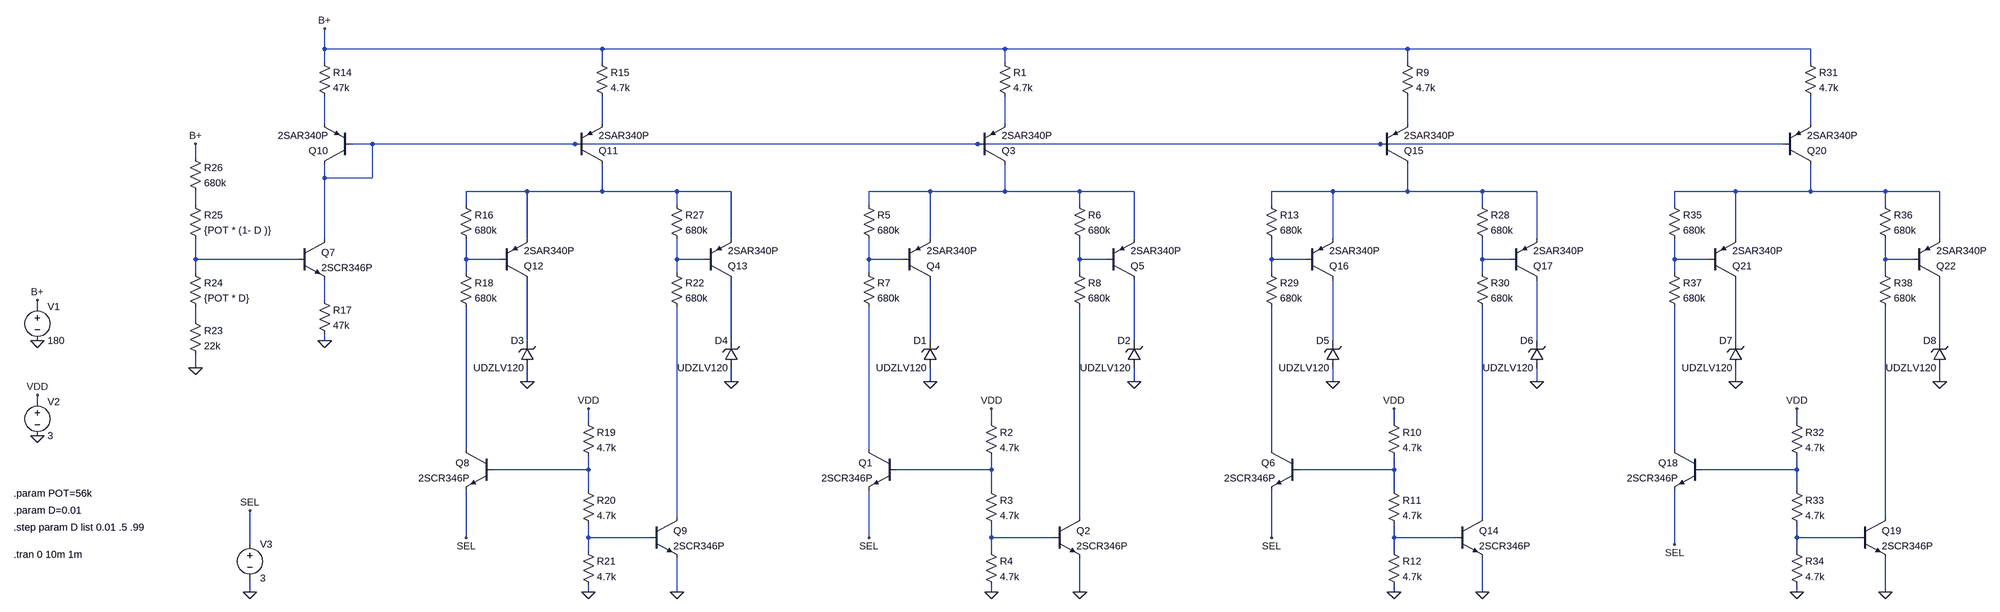
[diagram p0: schematic Constant Current Anode Switching.asc]
Constant Current Anode Switching.asc, the LTspice schematic file:
Version 4
SHEET 1 5280 1044
WIRE 736 -592 736 -640
WIRE 1552 -592 736 -592
WIRE 2640 -592 1552 -592
WIRE 3744 -592 2640 -592
WIRE 4832 -592 3744 -592
WIRE 736 -560 736 -592
WIRE 1552 -560 1552 -592
WIRE 2640 -560 2640 -592
WIRE 3744 -560 3744 -592
WIRE 4832 -560 4832 -592
WIRE 736 -416 736 -480
WIRE 1552 -416 1552 -480
WIRE 2640 -416 2640 -480
WIRE 3744 -416 3744 -480
WIRE 4832 -416 4832 -480
WIRE 848 -368 800 -368
WIRE 1488 -368 848 -368
WIRE 2576 -368 1488 -368
WIRE 3680 -368 2576 -368
WIRE 4768 -368 3680 -368
WIRE 432 -336 432 -368
WIRE 736 -288 736 -320
WIRE 848 -288 848 -368
WIRE 848 -288 736 -288
WIRE 1376 -256 1232 -256
WIRE 1552 -256 1552 -320
WIRE 1552 -256 1376 -256
WIRE 1728 -256 1552 -256
WIRE 1856 -256 1728 -256
WIRE 2464 -256 2320 -256
WIRE 2640 -256 2640 -320
WIRE 2640 -256 2464 -256
WIRE 2816 -256 2640 -256
WIRE 2944 -256 2816 -256
WIRE 3568 -256 3424 -256
WIRE 3744 -256 3744 -320
WIRE 3744 -256 3568 -256
WIRE 3920 -256 3744 -256
WIRE 4048 -256 3920 -256
WIRE 4656 -256 4512 -256
WIRE 4832 -256 4832 -320
WIRE 4832 -256 4656 -256
WIRE 5008 -256 4832 -256
WIRE 5136 -256 5008 -256
WIRE 432 -224 432 -256
WIRE 1232 -224 1232 -256
WIRE 1728 -224 1728 -256
WIRE 2320 -224 2320 -256
WIRE 2816 -224 2816 -256
WIRE 3424 -224 3424 -256
WIRE 3920 -224 3920 -256
WIRE 4512 -224 4512 -256
WIRE 5008 -224 5008 -256
WIRE 736 -144 736 -288
WIRE 1376 -144 1376 -256
WIRE 1856 -144 1856 -256
WIRE 2464 -144 2464 -256
WIRE 2944 -144 2944 -256
WIRE 3568 -144 3568 -256
WIRE 4048 -144 4048 -256
WIRE 4656 -144 4656 -256
WIRE 5136 -144 5136 -256
WIRE 432 -96 432 -144
WIRE 672 -96 432 -96
WIRE 1232 -96 1232 -144
WIRE 1312 -96 1232 -96
WIRE 1728 -96 1728 -144
WIRE 1792 -96 1728 -96
WIRE 2320 -96 2320 -144
WIRE 2400 -96 2320 -96
WIRE 2816 -96 2816 -144
WIRE 2880 -96 2816 -96
WIRE 3424 -96 3424 -144
WIRE 3504 -96 3424 -96
WIRE 3920 -96 3920 -144
WIRE 3984 -96 3920 -96
WIRE 4512 -96 4512 -144
WIRE 4592 -96 4512 -96
WIRE 5008 -96 5008 -144
WIRE 5072 -96 5008 -96
WIRE 432 -64 432 -96
WIRE 1232 -64 1232 -96
WIRE 1728 -64 1728 -96
WIRE 2320 -64 2320 -96
WIRE 2816 -64 2816 -96
WIRE 3424 -64 3424 -96
WIRE 3920 -64 3920 -96
WIRE 4512 -64 4512 -96
WIRE 5008 -64 5008 -96
WIRE 736 0 736 -48
WIRE -80 16 -80 0
WIRE 432 48 432 16
WIRE 736 96 736 80
WIRE 1376 96 1376 -48
WIRE 1856 96 1856 -48
WIRE 2464 96 2464 -48
WIRE 2944 96 2944 -48
WIRE 3568 96 3568 -48
WIRE 4048 96 4048 -48
WIRE 4656 96 4656 -48
WIRE 5136 96 5136 -48
WIRE 432 160 432 128
WIRE 1376 192 1376 160
WIRE 1856 192 1856 160
WIRE 2464 192 2464 160
WIRE 2944 192 2944 160
WIRE 3568 192 3568 160
WIRE 4048 192 4048 160
WIRE 4656 192 4656 160
WIRE 5136 192 5136 160
WIRE -80 240 -80 224
WIRE 1520 288 1520 256
WIRE 2608 288 2608 256
WIRE 3712 288 3712 256
WIRE 4800 288 4800 256
WIRE 1232 352 1232 16
WIRE 2320 352 2320 16
WIRE 3424 352 3424 16
WIRE 4512 352 4512 16
WIRE 1520 400 1520 368
WIRE 1520 400 1296 400
WIRE 2608 400 2608 368
WIRE 2608 400 2384 400
WIRE 3712 400 3712 368
WIRE 3712 400 3488 400
WIRE 4800 400 4800 368
WIRE 4800 400 4576 400
WIRE 1520 448 1520 400
WIRE 2608 448 2608 400
WIRE 3712 448 3712 400
WIRE 4800 448 4800 400
WIRE 1728 512 1728 16
WIRE 2816 512 2816 16
WIRE 3920 512 3920 16
WIRE 5008 512 5008 16
WIRE 1232 560 1232 448
WIRE 1520 560 1520 528
WIRE 1664 560 1520 560
WIRE 2320 560 2320 448
WIRE 2608 560 2608 528
WIRE 2752 560 2608 560
WIRE 3424 560 3424 448
WIRE 3712 560 3712 528
WIRE 3856 560 3712 560
WIRE 4800 560 4800 528
WIRE 4944 560 4800 560
WIRE 560 576 560 496
WIRE 4512 576 4512 448
WIRE 1520 592 1520 560
WIRE 2608 592 2608 560
WIRE 3712 592 3712 560
WIRE 4800 592 4800 560
WIRE 560 688 560 656
WIRE 1520 688 1520 672
WIRE 1728 688 1728 608
WIRE 2608 688 2608 672
WIRE 2816 688 2816 608
WIRE 3712 688 3712 672
WIRE 3920 688 3920 608
WIRE 4800 688 4800 672
WIRE 5008 688 5008 608
FLAG -80 96 0
FLAG -80 320 0
FLAG -80 0 B+
FLAG -80 224 VDD
FLAG 736 -640 B+
FLAG 1520 256 VDD
FLAG 1520 688 0
FLAG 1728 688 0
FLAG 736 96 0
FLAG 560 688 0
FLAG 1376 192 0
FLAG 1856 192 0
FLAG 432 160 0
FLAG 432 -368 B+
FLAG 2608 256 VDD
FLAG 2608 688 0
FLAG 2816 688 0
FLAG 2464 192 0
FLAG 2944 192 0
FLAG 3712 256 VDD
FLAG 3712 688 0
FLAG 3920 688 0
FLAG 3568 192 0
FLAG 4048 192 0
FLAG 4800 256 VDD
FLAG 4800 688 0
FLAG 5008 688 0
FLAG 4656 192 0
FLAG 5136 192 0
FLAG 560 496 SEL
FLAG 1232 560 SEL
FLAG 2320 560 SEL
FLAG 3424 560 SEL
FLAG 4512 576 SEL
SYMBOL voltage -80 0 R0
WINDOW 123 0 0 Left 0
WINDOW 39 0 0 Left 0
SYMATTR InstName V1
SYMATTR Value 180
SYMBOL voltage -80 224 R0
WINDOW 123 0 0 Left 0
WINDOW 39 0 0 Left 0
SYMATTR InstName V2
SYMATTR Value 3
SYMBOL npn 672 -144 R0
SYMATTR InstName Q7
SYMATTR Value 2SCR346P
SYMBOL npn 1296 352 M0
SYMATTR InstName Q8
SYMATTR Value 2SCR346P
SYMBOL npn 1664 512 R0
SYMATTR InstName Q9
SYMATTR Value 2SCR346P
SYMBOL pnp 800 -320 R180
SYMATTR InstName Q10
SYMATTR Value 2SAR340P
SYMBOL pnp 1488 -320 M180
SYMATTR InstName Q11
SYMATTR Value 2SAR340P
SYMBOL res 720 -576 R0
SYMATTR InstName R14
SYMATTR Value 47k
SYMBOL res 1536 -576 R0
SYMATTR InstName R15
SYMATTR Value 4.7k
SYMBOL res 720 -16 R0
SYMATTR InstName R17
SYMATTR Value 47k
SYMBOL res 1504 272 R0
SYMATTR InstName R19
SYMATTR Value 4.7k
SYMBOL res 1504 432 R0
SYMATTR InstName R20
SYMATTR Value 4.7k
SYMBOL res 1504 576 R0
SYMATTR InstName R21
SYMATTR Value 4.7k
SYMBOL voltage 560 560 R0
WINDOW 123 0 0 Left 0
WINDOW 39 0 0 Left 0
SYMATTR InstName V3
SYMATTR Value 3
SYMBOL zener 1392 160 R180
WINDOW 0 24 64 Left 2
WINDOW 3 24 0 Left 2
SYMATTR InstName D3
SYMATTR Value UDZLV120
SYMBOL zener 1872 160 R180
WINDOW 0 24 64 Left 2
WINDOW 3 24 0 Left 2
SYMATTR InstName D4
SYMATTR Value UDZLV120
SYMBOL res 416 32 R0
SYMATTR InstName R23
SYMATTR Value 22k
SYMBOL res 416 -80 R0
SYMATTR InstName R24
SYMATTR Value {POT * D}
SYMBOL res 416 -240 R0
SYMATTR InstName R25
SYMATTR Value {POT * (1- D )}
SYMBOL res 416 -352 R0
SYMATTR InstName R26
SYMATTR Value 680k
SYMBOL pnp 1312 -48 M180
SYMATTR InstName Q12
SYMATTR Value 2SAR340P
SYMBOL pnp 1792 -48 M180
SYMATTR InstName Q13
SYMATTR Value 2SAR340P
SYMBOL res 1216 -240 R0
SYMATTR InstName R16
SYMATTR Value 680k
SYMBOL res 1712 -240 R0
SYMATTR InstName R27
SYMATTR Value 680k
SYMBOL res 1216 -80 R0
SYMATTR InstName R18
SYMATTR Value 680k
SYMBOL res 1712 -80 R0
SYMATTR InstName R22
SYMATTR Value 680k
SYMBOL npn 2384 352 M0
SYMATTR InstName Q1
SYMATTR Value 2SCR346P
SYMBOL npn 2752 512 R0
SYMATTR InstName Q2
SYMATTR Value 2SCR346P
SYMBOL pnp 2576 -320 M180
SYMATTR InstName Q3
SYMATTR Value 2SAR340P
SYMBOL res 2624 -576 R0
SYMATTR InstName R1
SYMATTR Value 4.7k
SYMBOL res 2592 272 R0
SYMATTR InstName R2
SYMATTR Value 4.7k
SYMBOL res 2592 432 R0
SYMATTR InstName R3
SYMATTR Value 4.7k
SYMBOL res 2592 576 R0
SYMATTR InstName R4
SYMATTR Value 4.7k
SYMBOL zener 2480 160 R180
WINDOW 0 24 64 Left 2
WINDOW 3 24 0 Left 2
SYMATTR InstName D1
SYMATTR Value UDZLV120
SYMBOL zener 2960 160 R180
WINDOW 0 24 64 Left 2
WINDOW 3 24 0 Left 2
SYMATTR InstName D2
SYMATTR Value UDZLV120
SYMBOL pnp 2400 -48 M180
SYMATTR InstName Q4
SYMATTR Value 2SAR340P
SYMBOL pnp 2880 -48 M180
SYMATTR InstName Q5
SYMATTR Value 2SAR340P
SYMBOL res 2304 -240 R0
SYMATTR InstName R5
SYMATTR Value 680k
SYMBOL res 2800 -240 R0
SYMATTR InstName R6
SYMATTR Value 680k
SYMBOL res 2304 -80 R0
SYMATTR InstName R7
SYMATTR Value 680k
SYMBOL res 2800 -80 R0
SYMATTR InstName R8
SYMATTR Value 680k
SYMBOL npn 3488 352 M0
SYMATTR InstName Q6
SYMATTR Value 2SCR346P
SYMBOL npn 3856 512 R0
SYMATTR InstName Q14
SYMATTR Value 2SCR346P
SYMBOL pnp 3680 -320 M180
SYMATTR InstName Q15
SYMATTR Value 2SAR340P
SYMBOL res 3728 -576 R0
SYMATTR InstName R9
SYMATTR Value 4.7k
SYMBOL res 3696 272 R0
SYMATTR InstName R10
SYMATTR Value 4.7k
SYMBOL res 3696 432 R0
SYMATTR InstName R11
SYMATTR Value 4.7k
SYMBOL res 3696 576 R0
SYMATTR InstName R12
SYMATTR Value 4.7k
SYMBOL zener 3584 160 R180
WINDOW 0 24 64 Left 2
WINDOW 3 24 0 Left 2
SYMATTR InstName D5
SYMATTR Value UDZLV120
SYMBOL zener 4064 160 R180
WINDOW 0 24 64 Left 2
WINDOW 3 24 0 Left 2
SYMATTR InstName D6
SYMATTR Value UDZLV120
SYMBOL pnp 3504 -48 M180
SYMATTR InstName Q16
SYMATTR Value 2SAR340P
SYMBOL pnp 3984 -48 M180
SYMATTR InstName Q17
SYMATTR Value 2SAR340P
SYMBOL res 3408 -240 R0
SYMATTR InstName R13
SYMATTR Value 680k
SYMBOL res 3904 -240 R0
SYMATTR InstName R28
SYMATTR Value 680k
SYMBOL res 3408 -80 R0
SYMATTR InstName R29
SYMATTR Value 680k
SYMBOL res 3904 -80 R0
SYMATTR InstName R30
SYMATTR Value 680k
SYMBOL npn 4576 352 M0
SYMATTR InstName Q18
SYMATTR Value 2SCR346P
SYMBOL npn 4944 512 R0
SYMATTR InstName Q19
SYMATTR Value 2SCR346P
SYMBOL pnp 4768 -320 M180
SYMATTR InstName Q20
SYMATTR Value 2SAR340P
SYMBOL res 4816 -576 R0
SYMATTR InstName R31
SYMATTR Value 4.7k
SYMBOL res 4784 272 R0
SYMATTR InstName R32
SYMATTR Value 4.7k
SYMBOL res 4784 432 R0
SYMATTR InstName R33
SYMATTR Value 4.7k
SYMBOL res 4784 576 R0
SYMATTR InstName R34
SYMATTR Value 4.7k
SYMBOL zener 4672 160 R180
WINDOW 0 24 64 Left 2
WINDOW 3 24 0 Left 2
SYMATTR InstName D7
SYMATTR Value UDZLV120
SYMBOL zener 5152 160 R180
WINDOW 0 24 64 Left 2
WINDOW 3 24 0 Left 2
SYMATTR InstName D8
SYMATTR Value UDZLV120
SYMBOL pnp 4592 -48 M180
SYMATTR InstName Q21
SYMATTR Value 2SAR340P
SYMBOL pnp 5072 -48 M180
SYMATTR InstName Q22
SYMATTR Value 2SAR340P
SYMBOL res 4496 -240 R0
SYMATTR InstName R35
SYMATTR Value 680k
SYMBOL res 4992 -240 R0
SYMATTR InstName R36
SYMATTR Value 680k
SYMBOL res 4496 -80 R0
SYMATTR InstName R37
SYMATTR Value 680k
SYMBOL res 4992 -80 R0
SYMATTR InstName R38
SYMATTR Value 680k
TEXT -136 600 Left 2 !.tran 0 10m 1m
TEXT -136 496 Left 2 !.param D=0.01
TEXT -136 536 Left 2 !.step param D list 0.01 .5 .99
TEXT -136 456 Left 2 !.param POT=56k

The netlist it stands for:
* Constant Current Anode Switching.asc
V1 B+ 0 180
V2 VDD 0 3
Q7 N006 N012 N021 0 2SCR346P
Q8 N031 N035 SEL 0 2SCR346P
Q9 N039 N043 0 0 2SCR346P
Q10 N006 N006 N001 0 2SAR340P
Q11 N007 N006 N002 0 2SAR340P
R14 B+ N001 47k
R15 B+ N002 4.7k
R17 N021 0 47k
R19 VDD N035 4.7k
R20 N035 N043 4.7k
R21 N043 0 4.7k
V3 SEL 0 3
D3 0 N023 UDZLV120
D4 0 N024 UDZLV120
R23 N022 0 22k
R24 N012 N022 {POT * D}
R25 N011 N012 {POT * (1- D )}
R26 B+ N011 680k
Q12 N023 N013 N007 0 2SAR340P
Q13 N024 N014 N007 0 2SAR340P
R16 N007 N013 680k
R27 N007 N014 680k
R18 N013 N031 680k
R22 N014 N039 680k
Q1 N032 N036 SEL 0 2SCR346P
Q2 N040 N044 0 0 2SCR346P
Q3 N008 N006 N003 0 2SAR340P
R1 B+ N003 4.7k
R2 VDD N036 4.7k
R3 N036 N044 4.7k
R4 N044 0 4.7k
D1 0 N025 UDZLV120
D2 0 N026 UDZLV120
Q4 N025 N015 N008 0 2SAR340P
Q5 N026 N016 N008 0 2SAR340P
R5 N008 N015 680k
R6 N008 N016 680k
R7 N015 N032 680k
R8 N016 N040 680k
Q6 N033 N037 SEL 0 2SCR346P
Q14 N041 N045 0 0 2SCR346P
Q15 N009 N006 N004 0 2SAR340P
R9 B+ N004 4.7k
R10 VDD N037 4.7k
R11 N037 N045 4.7k
R12 N045 0 4.7k
D5 0 N027 UDZLV120
D6 0 N028 UDZLV120
Q16 N027 N017 N009 0 2SAR340P
Q17 N028 N018 N009 0 2SAR340P
R13 N009 N017 680k
R28 N009 N018 680k
R29 N017 N033 680k
R30 N018 N041 680k
Q18 N034 N038 SEL 0 2SCR346P
Q19 N042 N046 0 0 2SCR346P
Q20 N010 N006 N005 0 2SAR340P
R31 B+ N005 4.7k
R32 VDD N038 4.7k
R33 N038 N046 4.7k
R34 N046 0 4.7k
D7 0 N029 UDZLV120
D8 0 N030 UDZLV120
Q21 N029 N019 N010 0 2SAR340P
Q22 N030 N020 N010 0 2SAR340P
R35 N010 N019 680k
R36 N010 N020 680k
R37 N019 N034 680k
R38 N020 N042 680k
.model D D
.lib standard.dio
.model NPN NPN
.model PNP PNP
.lib standard.bjt
.tran 0 10m 1m
.param D=0.01
.step param D list 0.01 .5 .99
.param POT=56k
.backanno
.end